# EAGLE schematic helper_tray_storage_station_v4 (EAGLE 8.0.1)

## Sheet 1 of 5
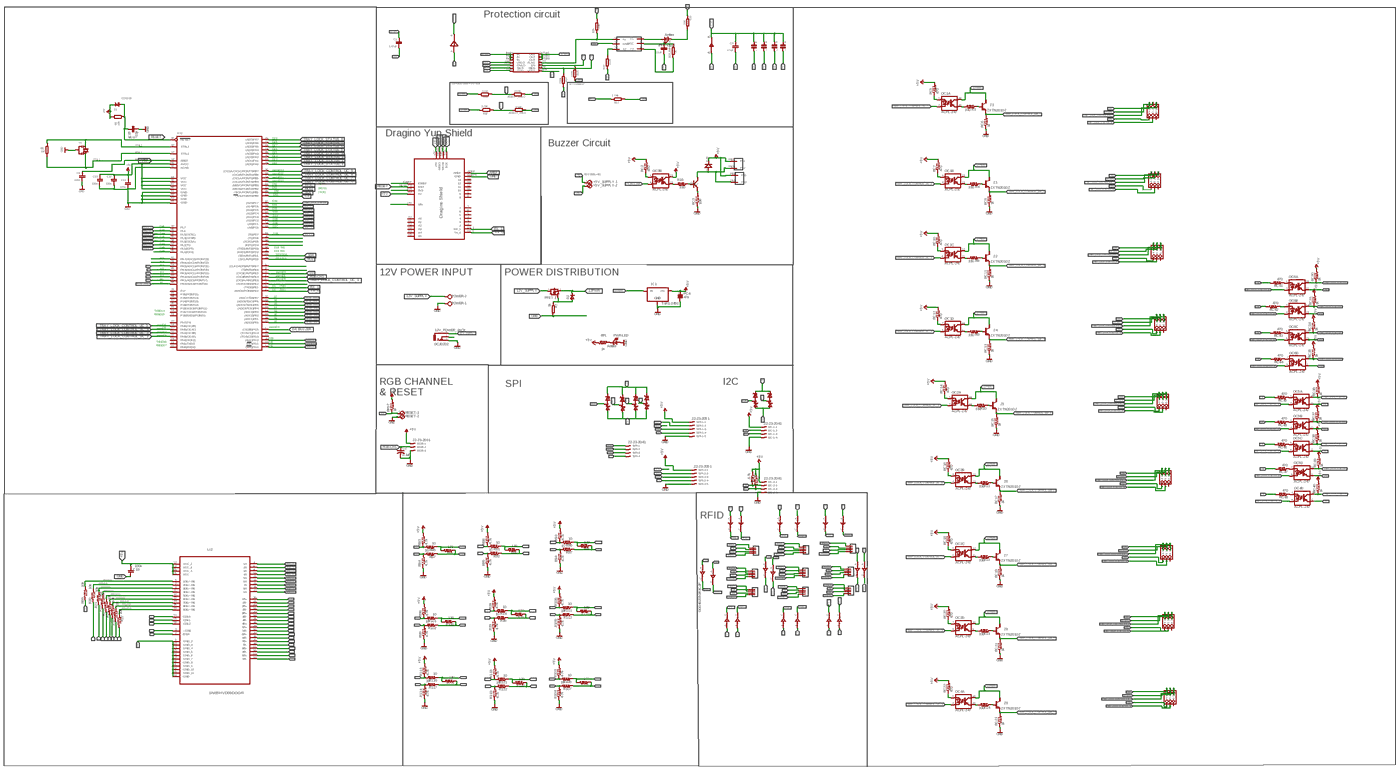
[diagram p0: schematic, sheet 1, overview]
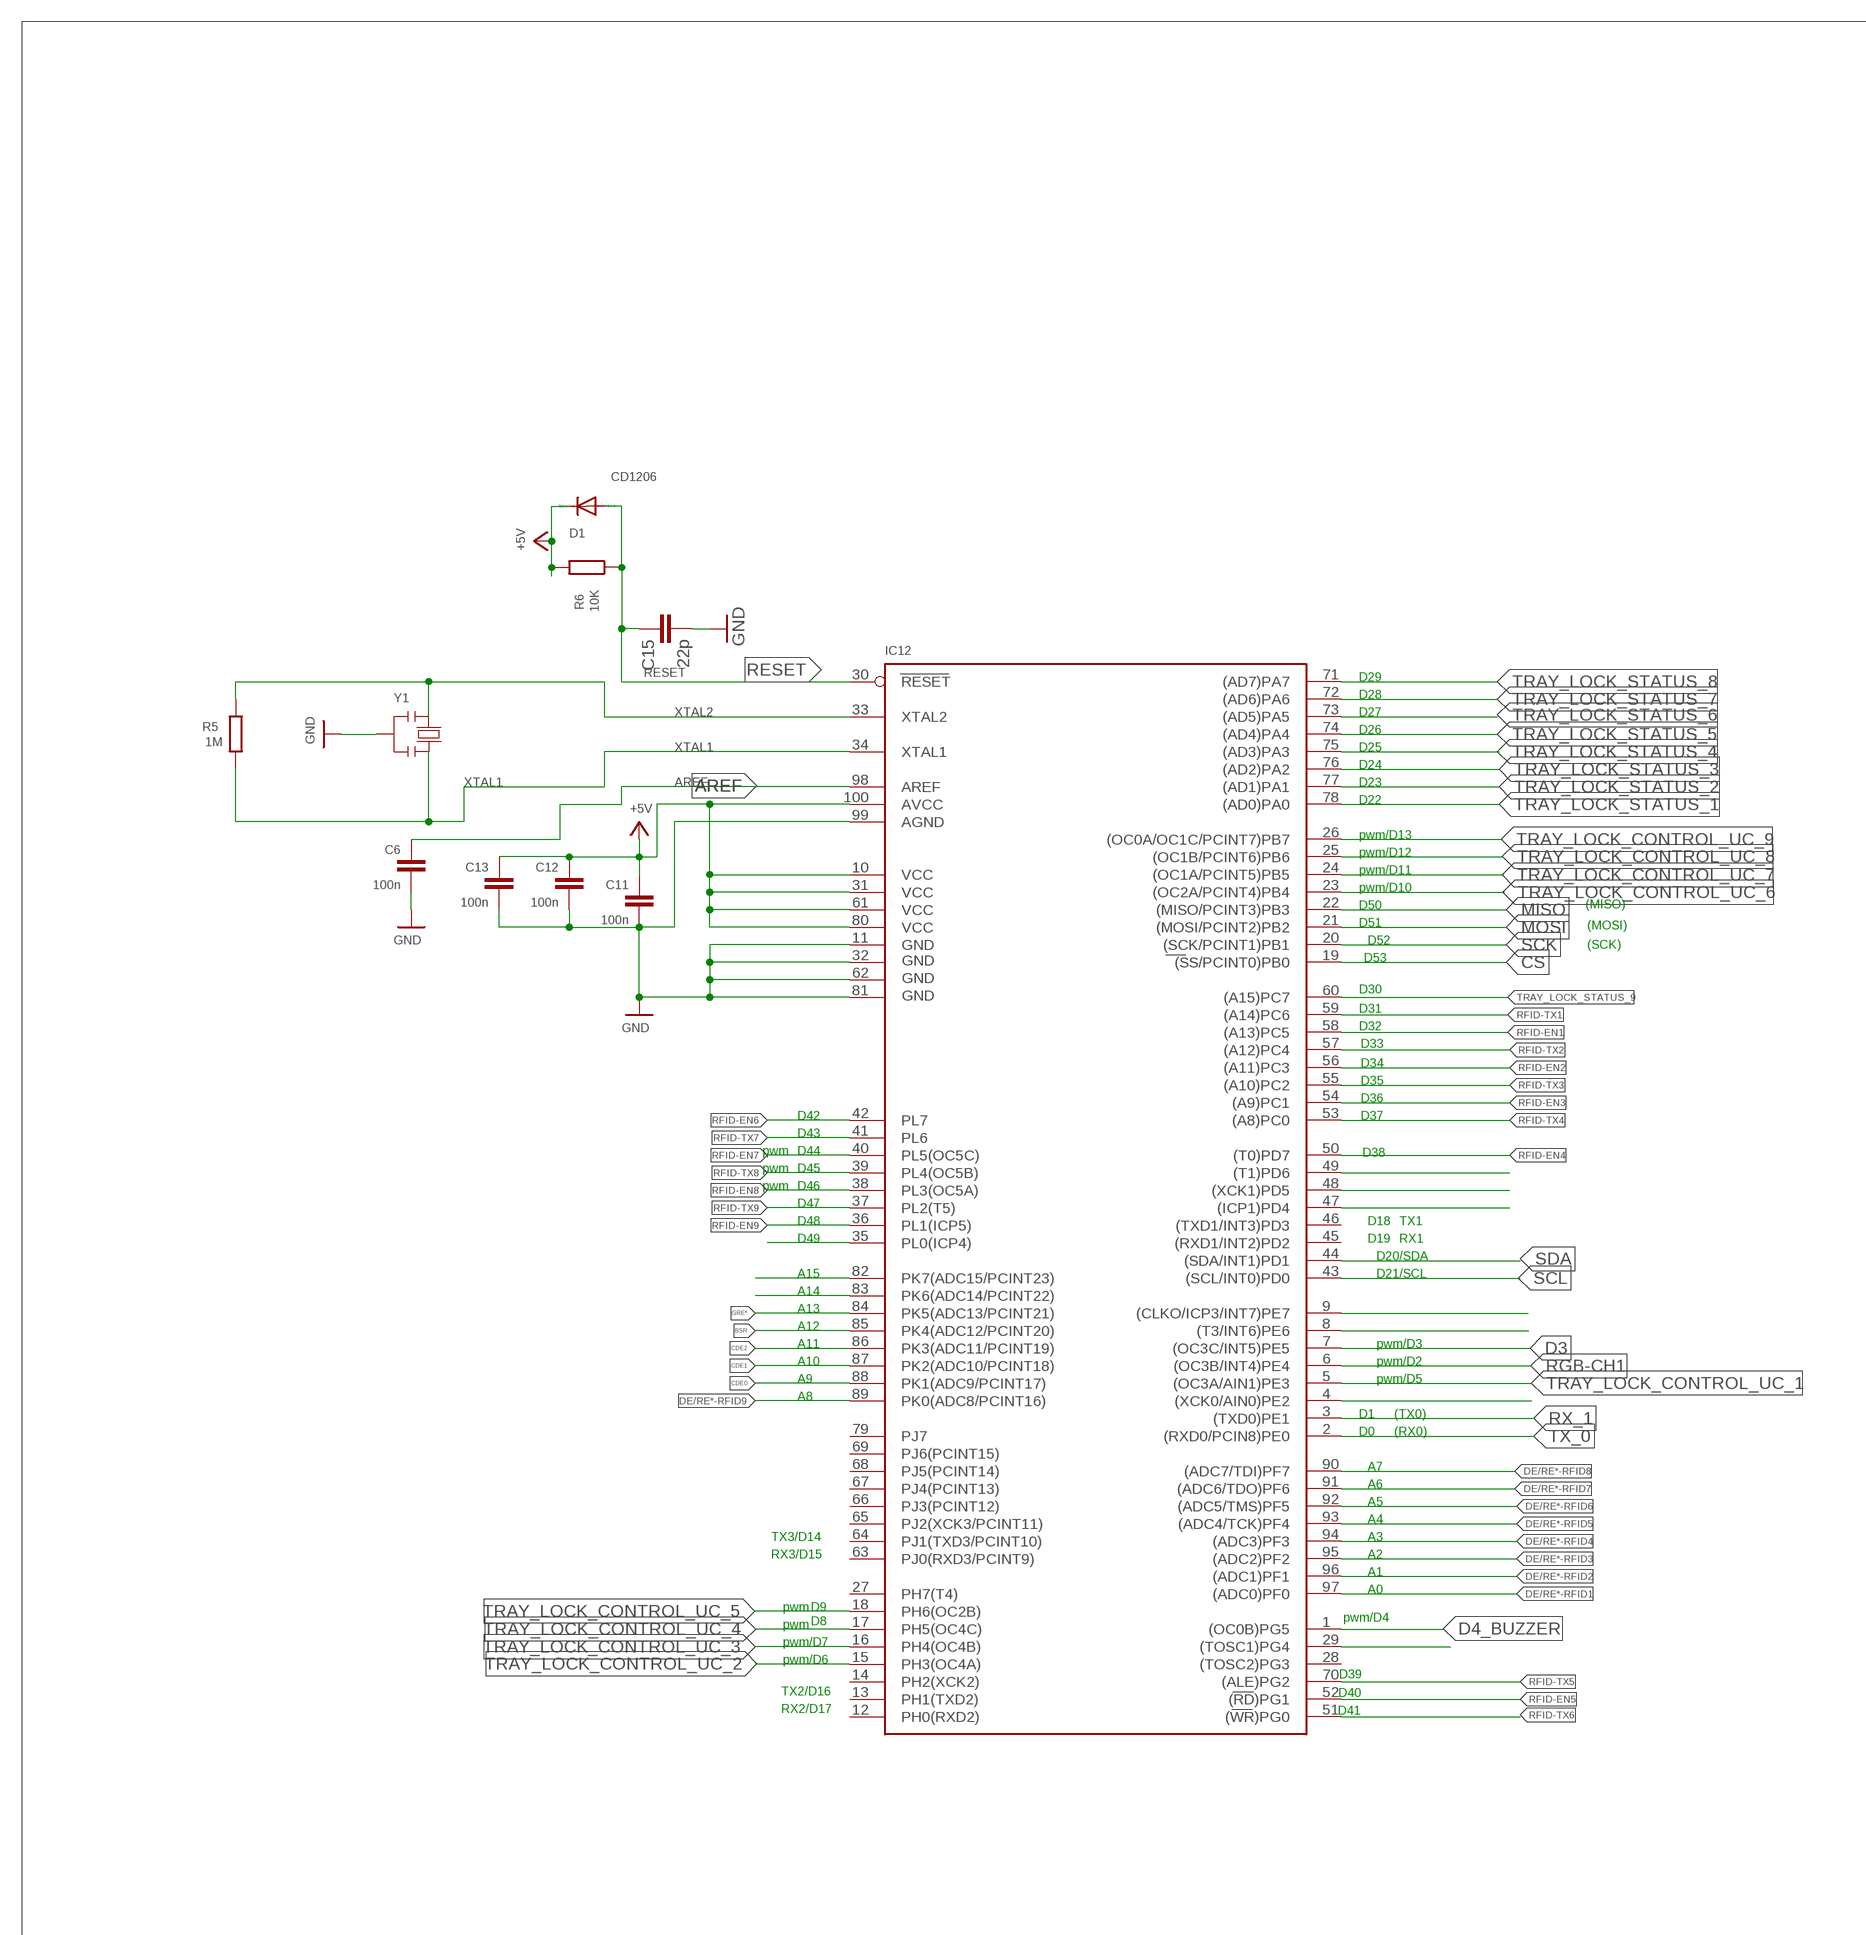
[diagram p1: schematic, sheet 1, part 1 of 6]
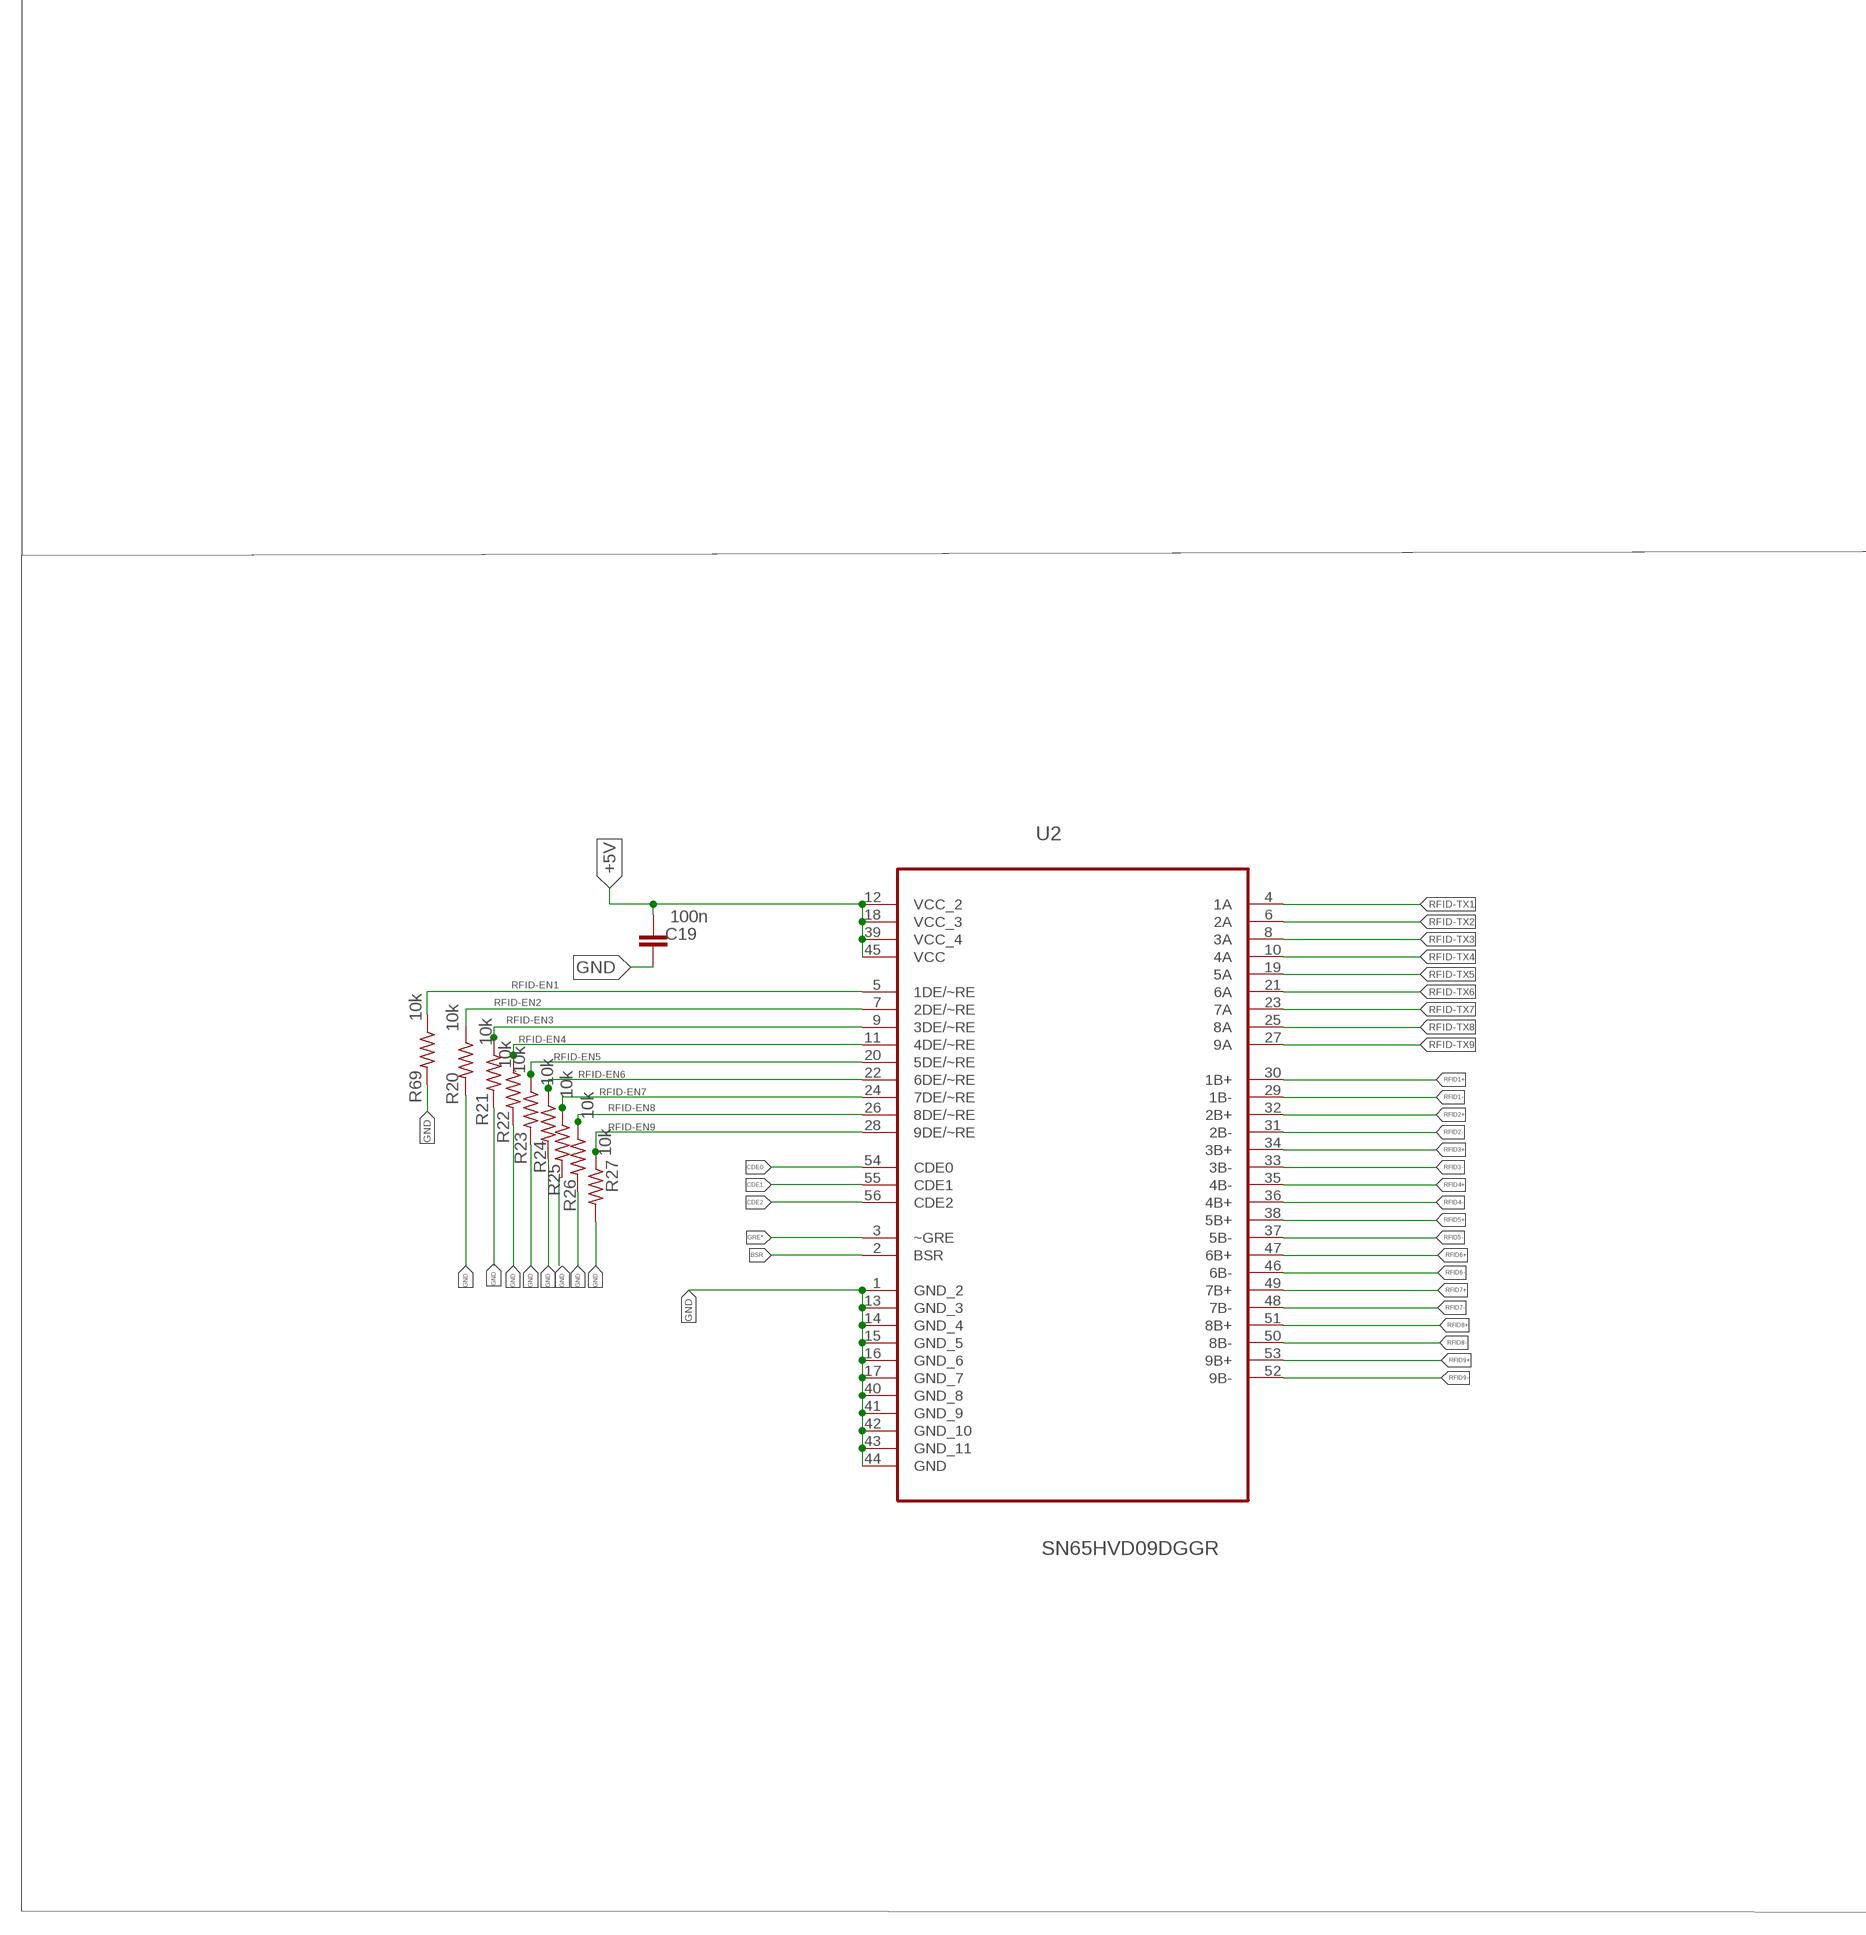
[diagram p2: schematic, sheet 1, part 2 of 6]
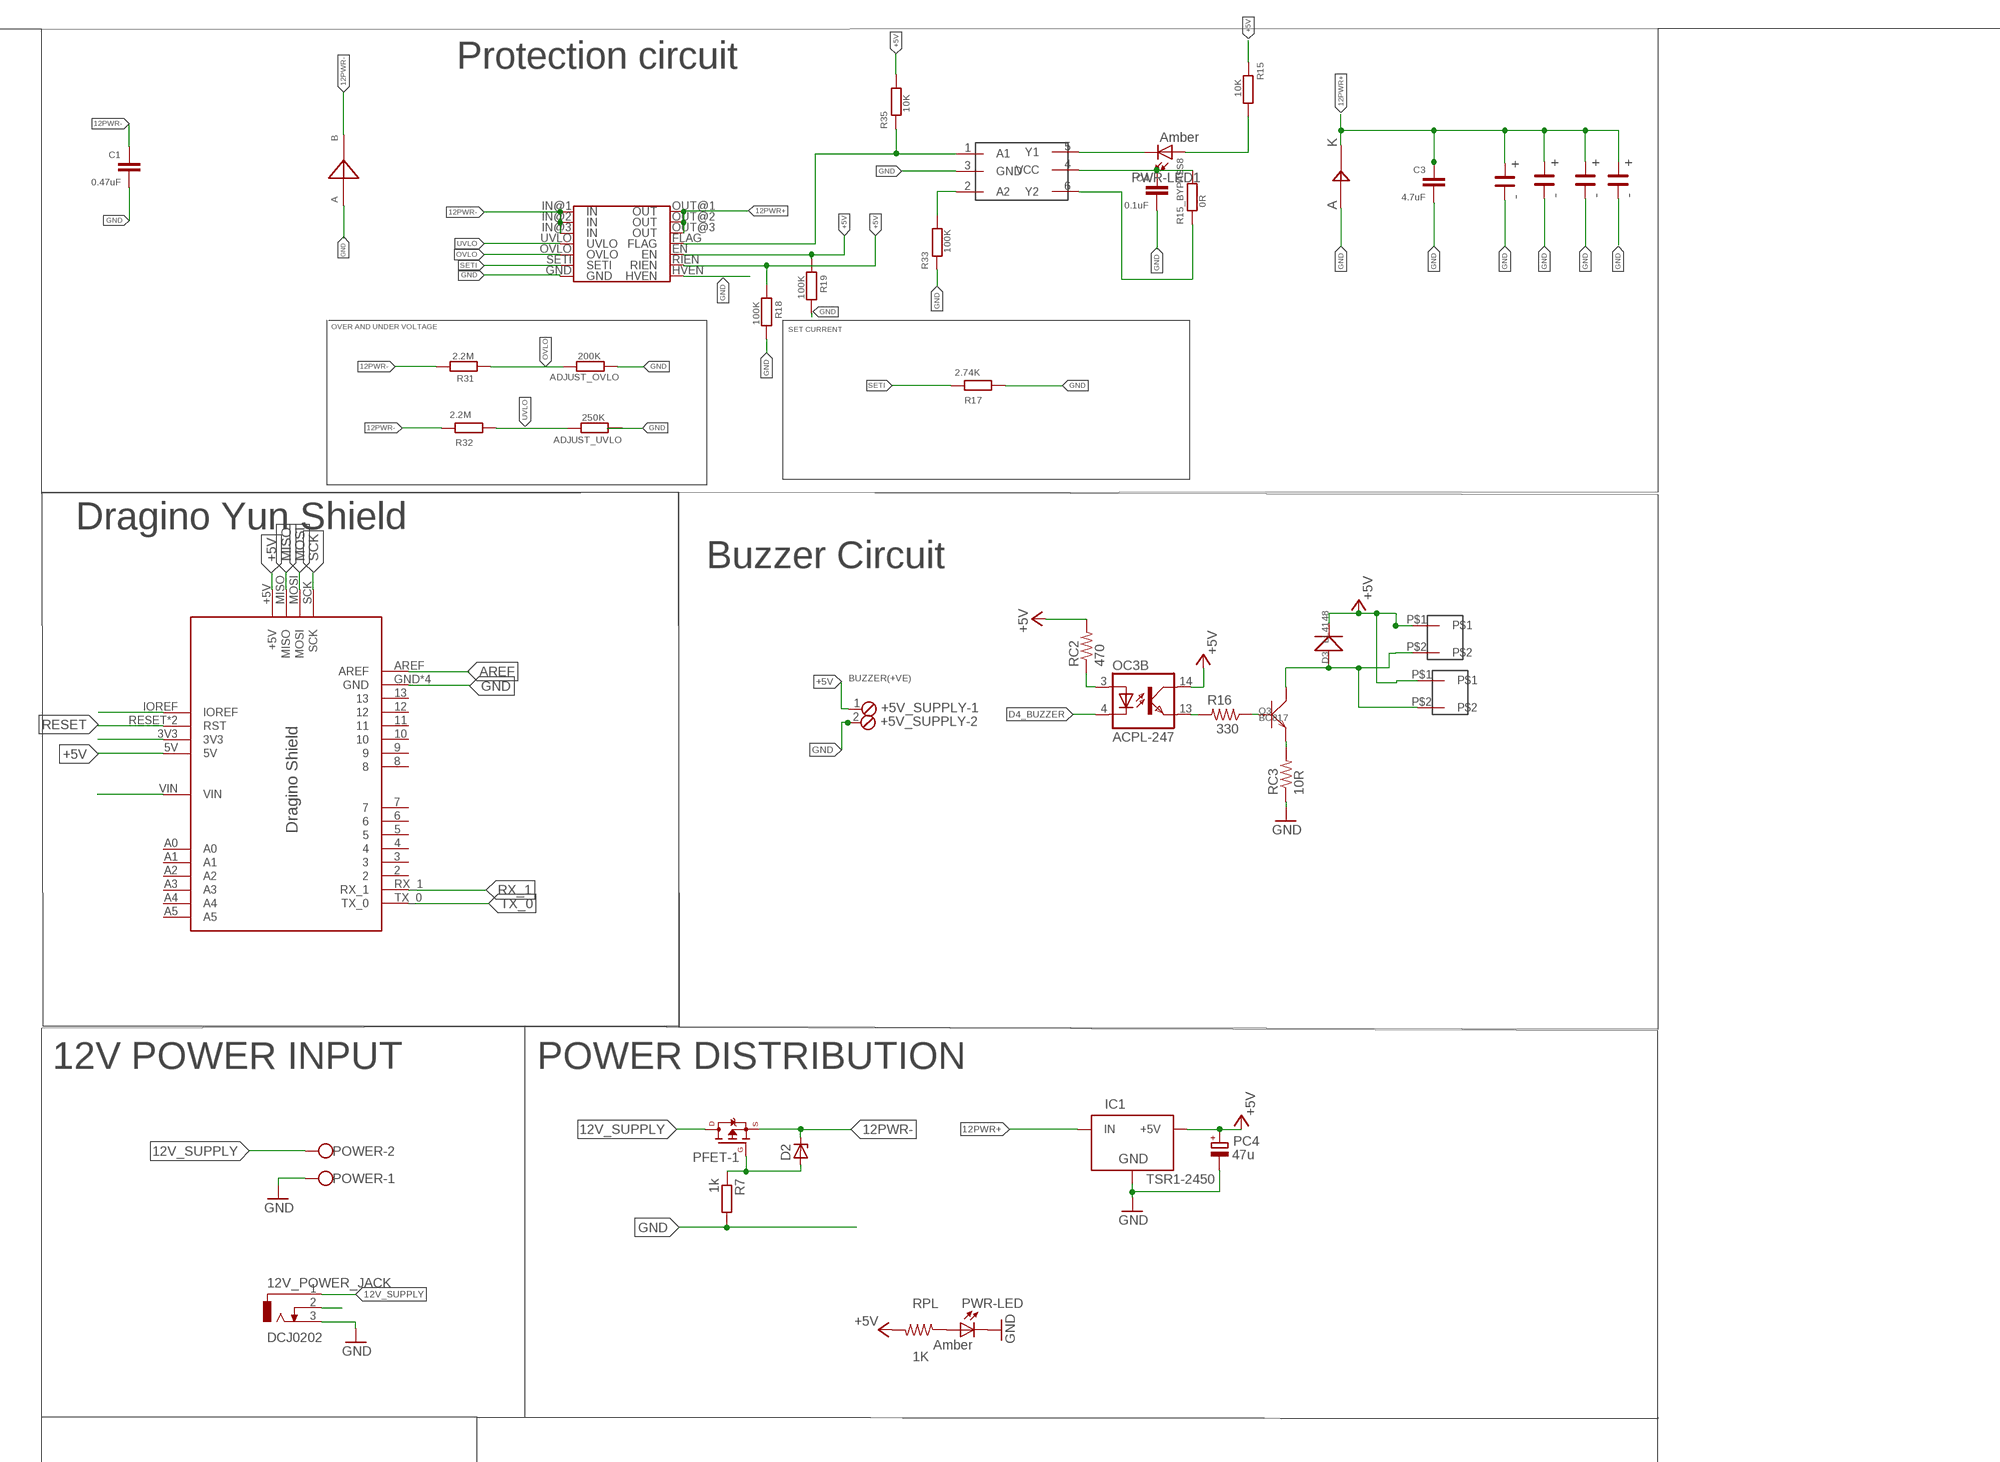
[diagram p3: schematic, sheet 1, part 3 of 6]
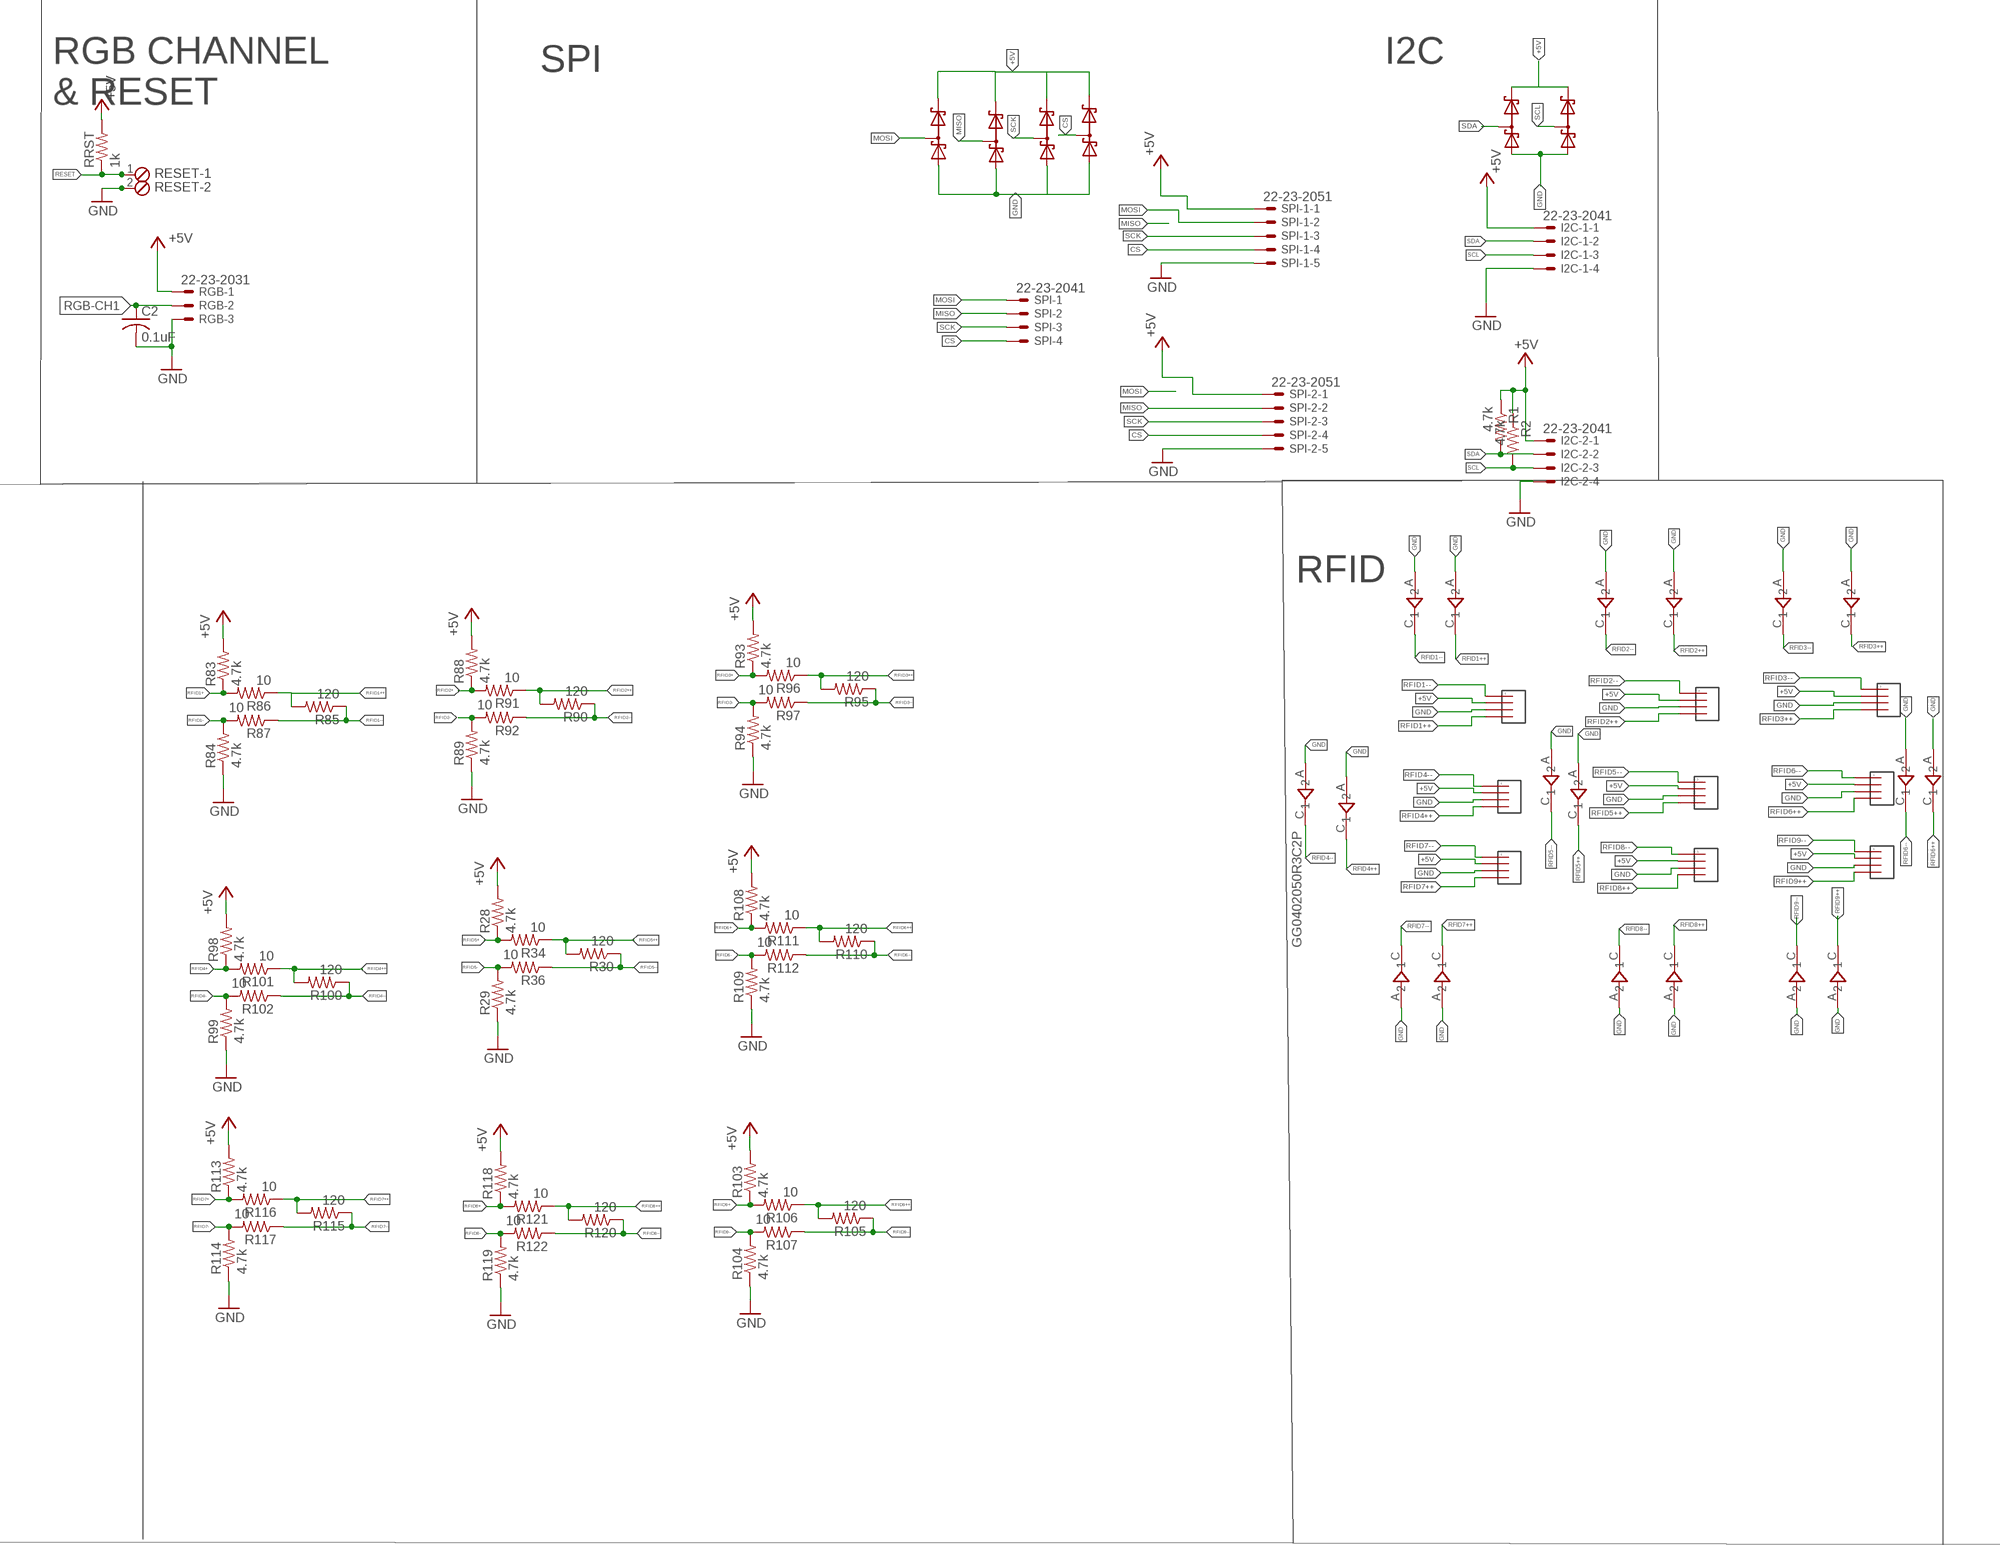
[diagram p4: schematic, sheet 1, part 4 of 6]
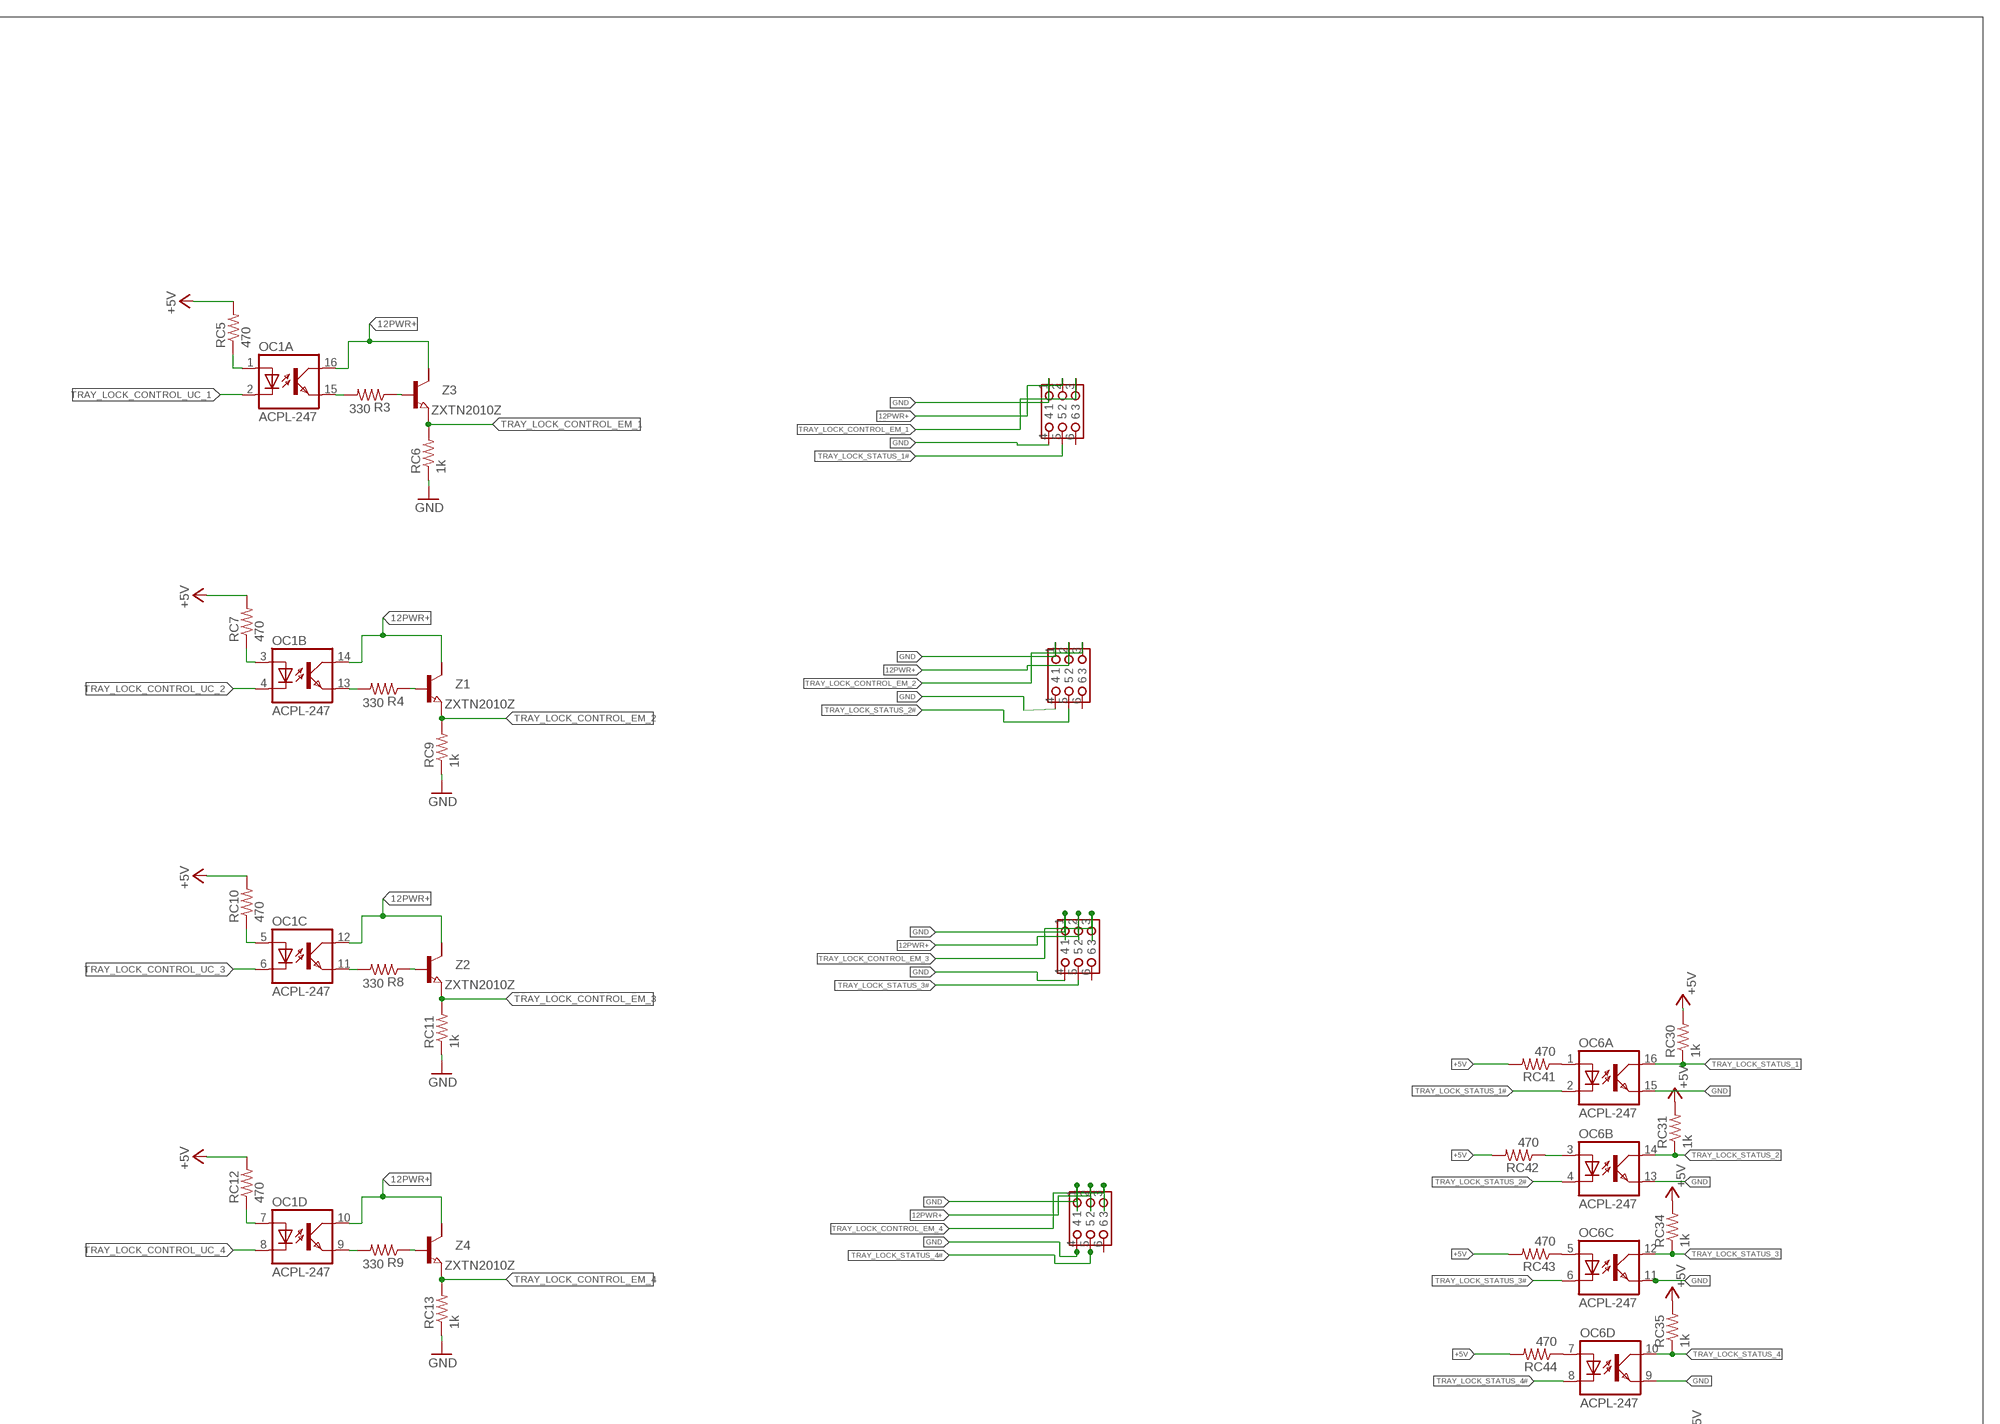
[diagram p5: schematic, sheet 1, part 5 of 6]
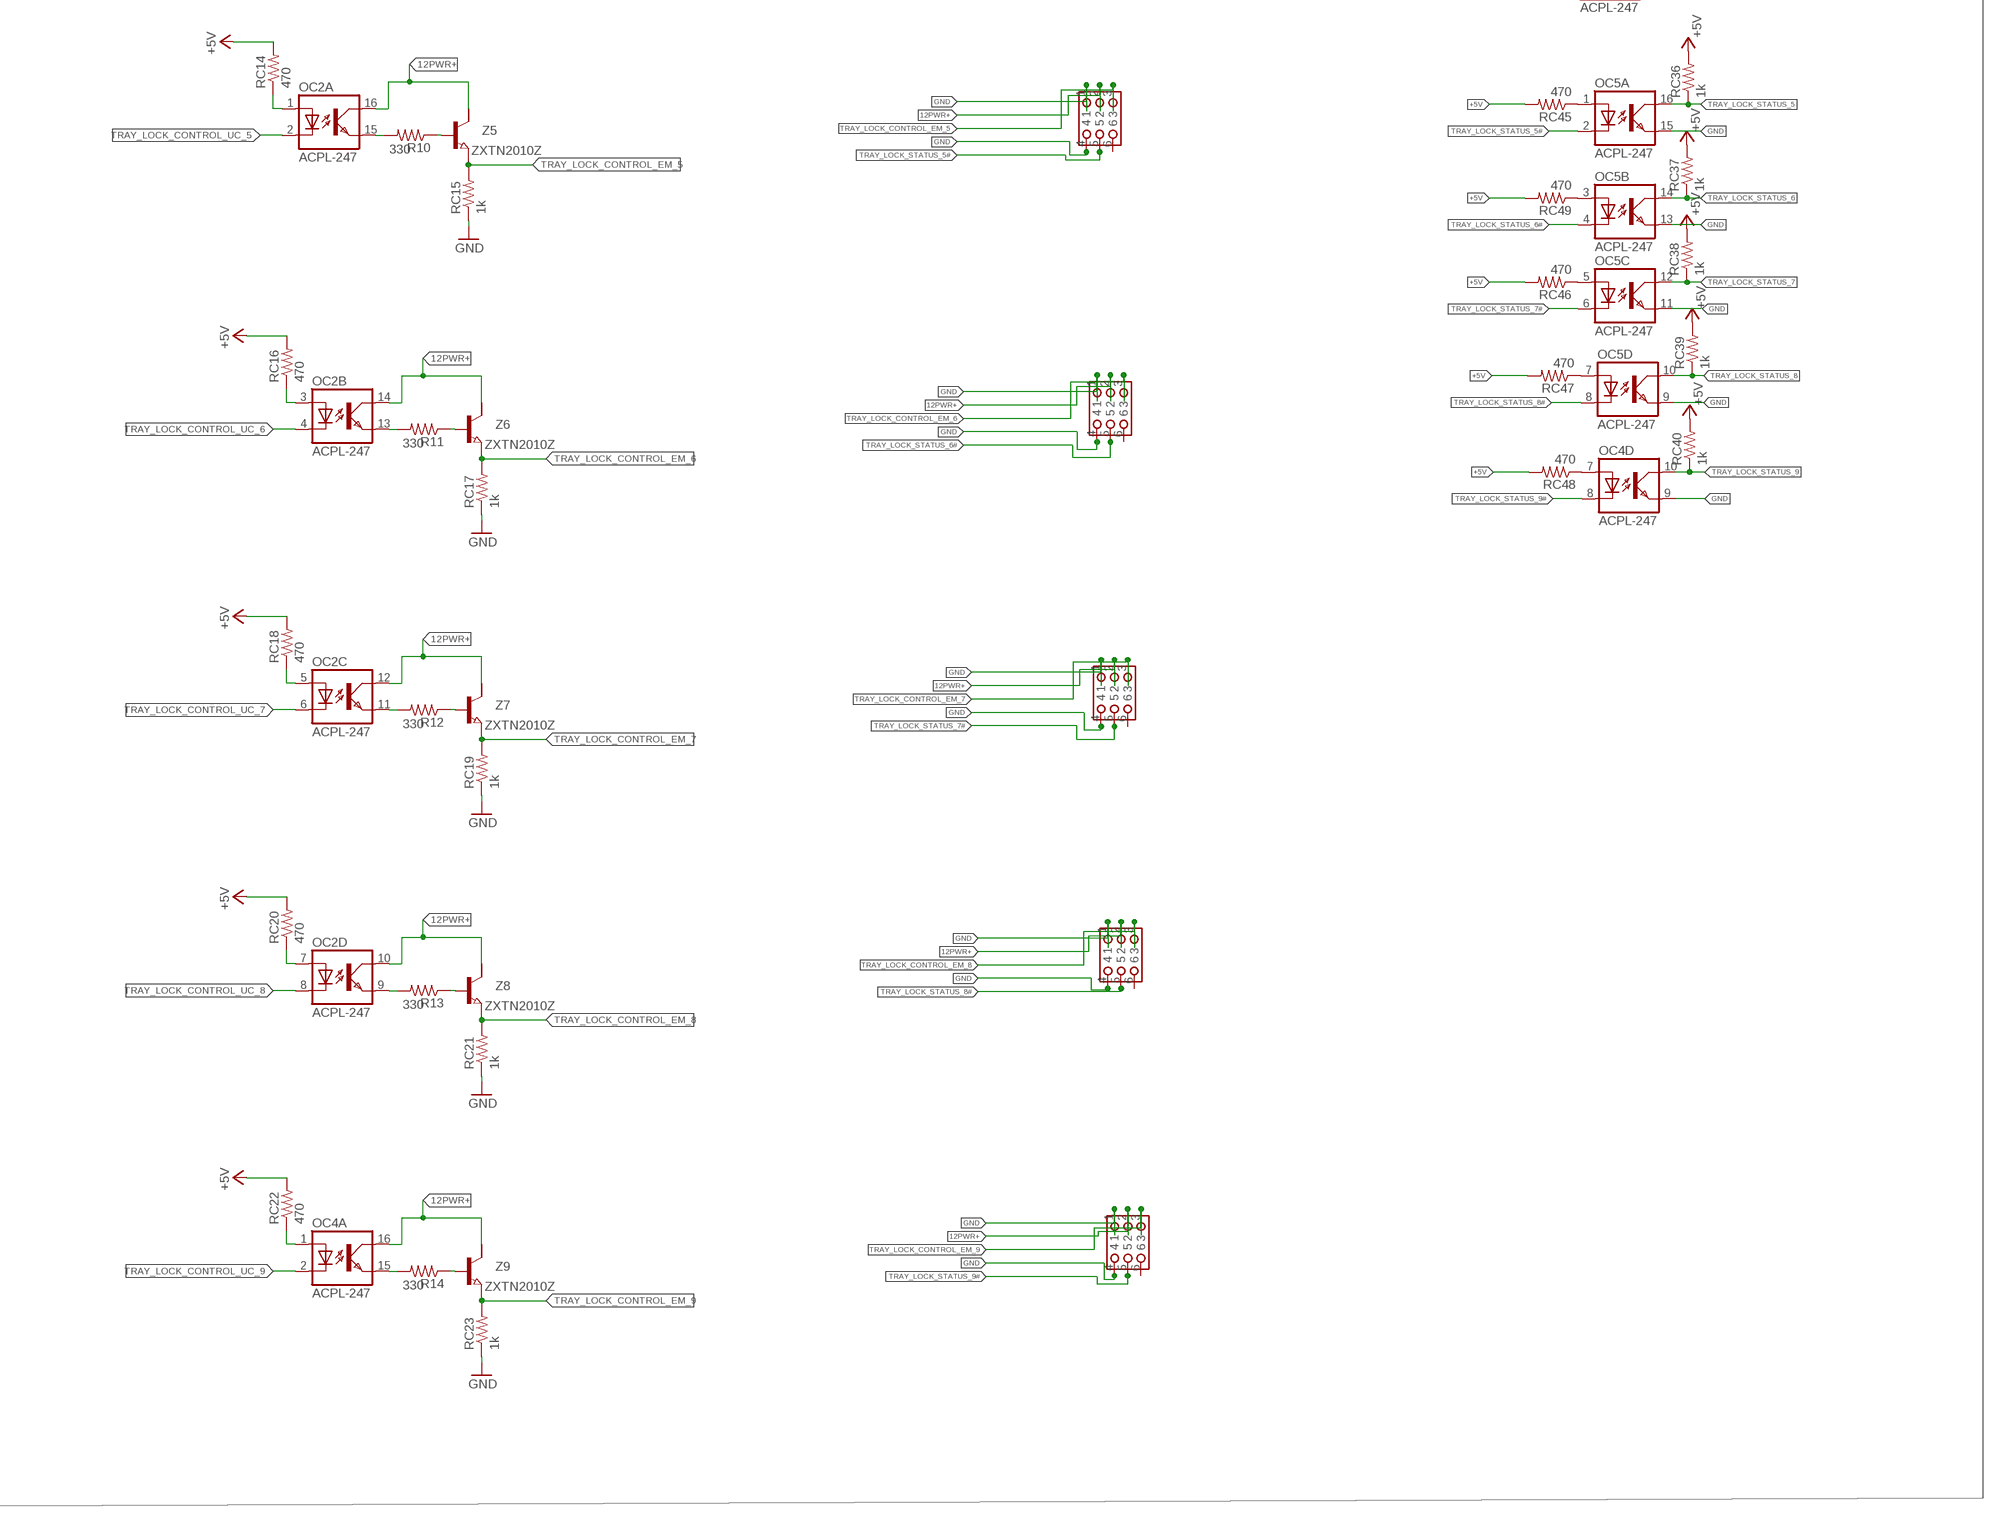
[diagram p6: schematic, sheet 1, part 6 of 6]

### Parts
12V_POWER_JACK  DCJ0202  [DCJ0202]
+5V_SUPPLY  MPT2  [2POL254]
ADJUST_OVLO  200K  R-EU_R0603  [R0603-ROUND]
ADJUST_UVLO  250K  R-EU_R0603  [R0603-ROUND]
C1  0.47uF  C-EU0603-RND  [C0603-ROUND]
C2  0.1uF  C-USC0603K  [C0603K]
C3  4.7uF  C-EU0603-RND  [C0603-ROUND]
C4  0.1uF  C-EU0603-RND  [C0603-ROUND]
C6  100n  C-EU0603-RND  [C0603-ROUND]
C11  100n  C-EU0603-RND  [C0603-ROUND]
C12  100n  C-EU0603-RND  [C0603-ROUND]
C13  100n  C-EU0603-RND  [C0603-ROUND]
C15  22p  C-EU0603-RND  [C0603-ROUND]
C19  100n  C-EU0603-RND  [C0603-ROUND]
D1  CD1206  DIODE-MINIMELF  [MINIMELF]
D2  1SMA5925BT3G  [DO214AC]
D3  LL4148  D'1N4148-SMD'  [LL-34]
I2C-1  22-23-2041  [22-23-2041]
I2C-2  22-23-2041  [22-23-2041]
IC1  TSR1-2450  [TSR-1]
IC12  ATMEGA25602560-16AU  [TQFP100]
OC1  ACPL-247  [SOP16]
OC2  ACPL-247  [SOP16]
OC3  ACPL-247  [SOP16]
OC4  ACPL-247  [SOP16]
OC5  ACPL-247  [SOP16]
OC6  ACPL-247  [SOP16]
PC4  47u  CPOL-EUD  [PANASONIC_D]
PFET-1  FQP47P06NORMAL  [FQP47P06-NORMAL]
POWER  W237-102  [W237-102]
PWR-LED  Amber  LED0603  [LED-0603]
PWR-LED1  Amber  LED0603  [LED-0603]
Q3  BC817  TRANSISTOR-NPN-SOT23  [SOT23]
R1  4.7k  RESISTOR0603-RES  [0603-RES]
R2  4.7k  RESISTOR0603-RES  [0603-RES]
R3  330  R-US_R0603  [R0603]
R4  330  R-US_R0603  [R0603]
R5  1M  R-EU_R0603  [R0603-ROUND]
R6  10K  R-EU_R0603  [R0603-ROUND]
R7  1k  R-EU_R0603  [R0603]
R8  330  R-US_R0603  [R0603]
R9  330  R-US_R0603  [R0603]
R10  330  R-US_R0603  [R0603]
R11  330  R-US_R0603  [R0603]
R12  330  R-US_R0603  [R0603]
R13  330  R-US_R0603  [R0603]
R14  330  R-US_R0603  [R0603]
R15  10K  R-EU_R0603  [R0603-ROUND]
R15_BYPASS8  0R  R-EU_R0603  [R0603-ROUND]
R16  330  R-US_R0603  [R0603]
R17  2.74K  R-EU_R0603  [R0603-ROUND]
R18  100K  R-EU_R0603  [R0603-ROUND]
R19  100K  R-EU_R0603  [R0603-ROUND]
R20  10k  R-US_R0603  [R0603]
R21  10k  R-US_R0603  [R0603]
R22  10k  R-US_R0603  [R0603]
R23  10k  R-US_R0603  [R0603]
R24  10k  R-US_R0603  [R0603]
R25  10k  R-US_R0603  [R0603]
R26  10k  R-US_R0603  [R0603]
R27  10k  R-US_R0603  [R0603]
R28  4.7k  R-US_R0603  [R0603]
R29  4.7k  R-US_R0603  [R0603]
R30  120  R-US_R0603  [R0603]
R31  2.2M  R-EU_R0603  [R0603-ROUND]
R32  2.2M  R-EU_R0603  [R0603-ROUND]
R33  100K  R-EU_R0603  [R0603-ROUND]
R34  10  R-US_R0603  [R0603]
R35  10K  R-EU_R0603  [R0603-ROUND]
R36  10  R-US_R0603  [R0603]
R69  10k  R-US_R0603  [R0603]
R83  4.7k  R-US_R0603  [R0603]
R84  4.7k  R-US_R0603  [R0603]
R85  120  R-US_R0603  [R0603]
R86  10  R-US_R0603  [R0603]
R87  10  R-US_R0603  [R0603]
R88  4.7k  R-US_R0603  [R0603]
R89  4.7k  R-US_R0603  [R0603]
R90  120  R-US_R0603  [R0603]
R91  10  R-US_R0603  [R0603]
R92  10  R-US_R0603  [R0603]
R93  4.7k  R-US_R0603  [R0603]
R94  4.7k  R-US_R0603  [R0603]
R95  120  R-US_R0603  [R0603]
R96  10  R-US_R0603  [R0603]
R97  10  R-US_R0603  [R0603]
R98  4.7k  R-US_R0603  [R0603]
R99  4.7k  R-US_R0603  [R0603]
R100  120  R-US_R0603  [R0603]
R101  10  R-US_R0603  [R0603]
R102  10  R-US_R0603  [R0603]
R103  4.7k  R-US_R0603  [R0603]
R104  4.7k  R-US_R0603  [R0603]
R105  120  R-US_R0603  [R0603]
R106  10  R-US_R0603  [R0603]
R107  10  R-US_R0603  [R0603]
R108  4.7k  R-US_R0603  [R0603]
R109  4.7k  R-US_R0603  [R0603]
R110  120  R-US_R0603  [R0603]
R111  10  R-US_R0603  [R0603]
R112  10  R-US_R0603  [R0603]
R113  4.7k  R-US_R0603  [R0603]
R114  4.7k  R-US_R0603  [R0603]
R115  120  R-US_R0603  [R0603]
R116  10  R-US_R0603  [R0603]
R117  10  R-US_R0603  [R0603]
R118  4.7k  R-US_R0603  [R0603]
R119  4.7k  R-US_R0603  [R0603]
R120  120  R-US_R0603  [R0603]
R121  10  R-US_R0603  [R0603]
R122  10  R-US_R0603  [R0603]
RC2  470  R-US_R0603  [R0603]
RC3  10R  R-US_R0603  [R0603]
RC5  470  R-US_R0603  [R0603]
RC6  1k  R-US_R0603  [R0603]
RC7  470  R-US_R0603  [R0603]
RC9  1k  R-US_R0603  [R0603]
RC10  470  R-US_R0603  [R0603]
RC11  1k  R-US_R0603  [R0603]
RC12  470  R-US_R0603  [R0603]
RC13  1k  R-US_R0603  [R0603]
RC14  470  R-US_R0603  [R0603]
RC15  1k  R-US_R0603  [R0603]
RC16  470  R-US_R0603  [R0603]
RC17  1k  R-US_R0603  [R0603]
RC18  470  R-US_R0603  [R0603]
RC19  1k  R-US_R0603  [R0603]
RC20  470  R-US_R0603  [R0603]
RC21  1k  R-US_R0603  [R0603]
RC22  470  R-US_R0603  [R0603]
RC23  1k  R-US_R0603  [R0603]
RC30  1k  R-US_R0603  [R0603]
RC31  1k  R-US_R0603  [R0603]
RC34  1k  R-US_R0603  [R0603]
RC35  1k  R-US_R0603  [R0603]
RC36  1k  R-US_R0603  [R0603]
RC37  1k  R-US_R0603  [R0603]
RC38  1k  R-US_R0603  [R0603]
RC39  1k  R-US_R0603  [R0603]
RC40  1k  R-US_R0603  [R0603]
RC41  470  R-US_R0603  [R0603]
RC42  470  R-US_R0603  [R0603]
RC43  470  R-US_R0603  [R0603]
RC44  470  R-US_R0603  [R0603]
RC45  470  R-US_R0603  [R0603]
RC46  470  R-US_R0603  [R0603]
RC47  470  R-US_R0603  [R0603]
RC48  470  R-US_R0603  [R0603]
RC49  470  R-US_R0603  [R0603]
RESET  MPT2  [2POL254]
RFID-1  MOLEX-105309-1104  [MOLEX-105309-1104]
RFID-2  MOLEX-105309-1104  [MOLEX-105309-1104]
RFID-3  MOLEX-105309-1104  [MOLEX-105309-1104]
RFID-4  MOLEX-105309-1104  [MOLEX-105309-1104]
RFID-5  MOLEX-105309-1104  [MOLEX-105309-1104]
RFID-6  MOLEX-105309-1104  [MOLEX-105309-1104]
RFID-7  MOLEX-105309-1104  [MOLEX-105309-1104]
RFID-8  MOLEX-105309-1104  [MOLEX-105309-1104]
RGB  22-23-2031  [22-23-2031]
RPL  1K  RESISTOR0603-RES  [0603-RES]
RRST  1k  R-US_R0603  [R0603]
SPI  22-23-2041  [22-23-2041]
SPI-1  22-23-2051  [22-23-2051]
SPI-2  22-23-2051  [22-23-2051]
U2  SN65HVD09DGGR  [SOP50P810X120-56N]
U$1  DRAGINO_SHIELD  [DRAGINO_SHIELD]
U$2  BUZZER  [BUZZER]
U$3  BUZZER  [BUZZER]
U$4  GG0402050R3C2P  [0402]
U$5  43045-0624-0624_CONNECTOR_2X3  [43045-0624_CONNECTOR_2X3]
U$6  43045-0624-0624_CONNECTOR_2X3  [43045-0624_CONNECTOR_2X3]
U$7  43045-0624-0624_CONNECTOR_2X3  [43045-0624_CONNECTOR_2X3]
U$8  43045-0624-0624_CONNECTOR_2X3  [43045-0624_CONNECTOR_2X3]
U$9  43045-0624-0624_CONNECTOR_2X3  [43045-0624_CONNECTOR_2X3]
U$10  43045-0624-0624_CONNECTOR_2X3  [43045-0624_CONNECTOR_2X3]
U$11  43045-0624-0624_CONNECTOR_2X3  [43045-0624_CONNECTOR_2X3]
U$12  43045-0624-0624_CONNECTOR_2X3  [43045-0624_CONNECTOR_2X3]
U$13  43045-0624-0624_CONNECTOR_2X3  [43045-0624_CONNECTOR_2X3]
U$14  GG0402050R3C2P  [0402]
U$15  GG0402050R3C2P  [0402]
U$16  GG0402050R3C2P  [0402]
U$17  GG0402050R3C2P  [0402]
U$18  GG0402050R3C2P  [0402]
U$19  GG0402050R3C2P  [0402]
U$20  GG0402050R3C2P  [0402]
U$21  GG0402050R3C2P  [0402]
U$22  GG0402050R3C2P  [0402]
U$23  GG0402050R3C2P  [0402]
U$24  GG0402050R3C2P  [0402]
U$25  GG0402050R3C2P  [0402]
U$26  GG0402050R3C2P  [0402]
U$27  GG0402050R3C2P  [0402]
U$28  GG0402050R3C2P  [0402]
U$29  GG0402050R3C2P  [0402]
U$30  GG0402050R3C2P  [0402]
U$31  NUP1301SOT23  [SOT23]
U$32  NUP1301SOT23  [SOT23]
U$33  NUP1301SOT23  [SOT23]
U$34  NUP1301SOT23  [SOT23]
U$35  NUP1301SOT23  [SOT23]
U$36  NUP1301SOT23  [SOT23]
U$37  MAX14571  [TSSOP14]
U$38  STPS5L60S  [SMC]
U$39  SM6T36CA  [DO214AA]
U$40  NC7WZ07P6X  [SC70-6L]
U$41  EEV-FK1H331Q  [EEVFK1H331Q]
U$42  EEV-FK1H331Q  [EEVFK1H331Q]
U$43  EEV-FK1H331Q  [EEVFK1H331Q]
U$44  EEV-FK1H331Q  [EEVFK1H331Q]
U$53  MOLEX-105309-1104  [MOLEX-105309-1104]
Y1  RESONATORMU  [RESONATOR]
Z1  ZXTN2010Z  NPN-TRANSISTIOR-2COLSOT89  [SOT89]
Z2  ZXTN2010Z  NPN-TRANSISTIOR-2COLSOT89  [SOT89]
Z3  ZXTN2010Z  NPN-TRANSISTIOR-2COLSOT89  [SOT89]
Z4  ZXTN2010Z  NPN-TRANSISTIOR-2COLSOT89  [SOT89]
Z5  ZXTN2010Z  NPN-TRANSISTIOR-2COLSOT89  [SOT89]
Z6  ZXTN2010Z  NPN-TRANSISTIOR-2COLSOT89  [SOT89]
Z7  ZXTN2010Z  NPN-TRANSISTIOR-2COLSOT89  [SOT89]
Z8  ZXTN2010Z  NPN-TRANSISTIOR-2COLSOT89  [SOT89]
Z9  ZXTN2010Z  NPN-TRANSISTIOR-2COLSOT89  [SOT89]

### Nets
12PWR+ [PWR]: C3.1 IC1.1(IN) OC1.10(D:COL) OC1.12(C:COL) OC1.14(B:COL) OC1.16(A:COL) OC2.10(D:COL) OC2.12(C:COL) OC2.14(B:COL) OC2.16(A:COL) OC4.16(A:COL) U$5.2 U$6.2 U$7.2 U$8.2 U$9.2 U$10.2 U$11.2 U$12.2 U$13.2 U$37.OUT@1(OUT) U$37.OUT@2(OUT) U$37.OUT@3(OUT) U$38.1 U$41.P$2 U$42.P$2 U$43.P$2 U$44.P$2 Z1.2(C) Z2.2(C) Z3.2(C) Z4.2(C) Z5.2(C) Z6.2(C) Z7.2(C) Z8.2(C) Z9.2(C)
12PWR- [PWR]: C1.1 D2.C PFET-1.3(S) R31.1 R32.1 U$37.IN@1(IN) U$37.IN@2(IN) U$37.IN@3(IN) U$39.C
12V_SUPPLY [PWR]: 12V_POWER_JACK.1 PFET-1.2(D) POWER.2
+5V [power]: +5V_SUPPLY.1 C4.1 C11.1 C12.1 C13.1 C19.1 D1.C D3.C(-) I2C-1.1 I2C-2.1 IC1.3(+5V) IC12.10(VCC) IC12.31(VCC1) IC12.61(VCC2) IC12.80(VCC3) IC12.100(AVCC) OC3.14(B:COL) PC4.+ R1.1 R2.1 R6.2 R15.2 R15_BYPASS8.1 R18.2 R19.2 R28.2 R35.1 R83.2 R88.2 R93.2 R98.2 R103.2 R108.2 R113.2 R118.2 RC2.2 RC5.2 RC7.2 RC10.2 RC12.2 RC14.2 RC16.2 RC18.2 RC20.2 RC22.2 RC30.2 RC31.2 RC34.2 RC35.2 RC36.2 RC37.2 RC38.2 RC39.2 RC40.2 RC41.2 RC42.2 RC43.2 RC44.2 RC45.2 RC46.2 RC47.2 RC48.2 RC49.2 RFID-1.P$2 RFID-2.P$2 RFID-3.P$2 RFID-4.P$2 RFID-5.P$2 RFID-6.P$2 RFID-7.P$2 RFID-8.P$2 RGB.1 RPL.2 RRST.2 SPI-1.1 SPI-2.1 U2.12(VCC_2) U2.18(VCC_3) U2.39(VCC_4) U2.45(VCC) U$1.5V U$1.+5V U$2.P$1 U$3.P$1 U$31.2(A2) U$32.2(A2) U$33.2(A2) U$34.2(A2) U$35.2(A2) U$36.2(A2) U$37.EN U$37.RIEN U$40.4(VCC) U$53.P$2
AREF: C6.1 IC12.98(AREF) U$1.AREF
BSR: IC12.85(PK4(ADC12/PCINT20)) U2.2(BSR)
CDE0: IC12.88(PK1(ADC9/PCINT17)) U2.54(CDE0)
CDE1: IC12.87(PK2(ADC10/PCINT18)) U2.55(CDE1)
CDE2: IC12.86(PK3(ADC11/PCINT19)) U2.56(CDE2)
CHARGER-PLUG-SENSOR: 12V_POWER_JACK.2
CS: IC12.19((SS/PCINT0)PB0) SPI-1.4 SPI-2.4 SPI.4 U$34.3(K1K2)
D3: IC12.7((OC3C/INT5)PE5)
D4_BUZZER: IC12.1((OC0B)PG5) OC3.4(B:C)
DE/RE*-RFID1: IC12.97((ADC0)PF0)
DE/RE*-RFID2: IC12.96((ADC1)PF1)
DE/RE*-RFID3: IC12.95((ADC2)PF2)
DE/RE*-RFID4: IC12.94((ADC3)PF3)
DE/RE*-RFID5: IC12.93((ADC4/TCK)PF4)
DE/RE*-RFID6: IC12.92((ADC5/TMS)PF5)
DE/RE*-RFID7: IC12.91((ADC6/TDO)PF6)
DE/RE*-RFID8: IC12.90((ADC7/TDI)PF7)
DE/RE*-RFID9: IC12.89(PK0(ADC8/PCINT16))
GND [PWR]: 12V_POWER_JACK.3 +5V_SUPPLY.2 ADJUST_OVLO.2 ADJUST_UVLO.2 C1.2 C2.2 C3.2 C4.2 C6.2 C11.2 C12.2 C13.2 C15.2 C19.2 I2C-1.4 I2C-2.4 IC1.2(GND) IC12.11(GND) IC12.32(GND1) IC12.62(GND2) IC12.81(GND3) IC12.99(AGND) OC4.9(D:EMIT) OC5.9(D:EMIT) OC5.11(C:EMIT) OC5.13(B:EMIT) OC5.15(A:EMIT) OC6.9(D:EMIT) OC6.11(C:EMIT) OC6.13(B:EMIT) OC6.15(A:EMIT) PC4.- POWER.1 PWR-LED.C R7.2 R17.2 R18.1 R19.1 R20.2 R21.2 R22.2 R23.2 R24.2 R25.2 R26.2 R27.2 R29.1 R33.2 R69.2 R84.1 R89.1 R94.1 R99.1 R104.1 R109.1 R114.1 R119.1 RC3.1 RC6.1 RC9.1 RC11.1 RC13.1 RC15.1 RC17.1 RC19.1 RC21.1 RC23.1 RESET.2 RFID-1.P$3 RFID-2.P$3 RFID-3.P$3 RFID-4.P$3 RFID-5.P$3 RFID-6.P$3 RFID-7.P$3 RFID-8.P$3 RGB.3 SPI-1.5 SPI-2.5 U2.1(GND_2) U2.13(GND_3) U2.14(GND_4) U2.15(GND_5) U2.16(GND_6) U2.17(GND_7) U2.40(GND_8) U2.41(GND_9) U2.42(GND_10) U2.43(GND_11) U2.44(GND) U$1.GND U$1.GND@1(GND) U$1.GND@2(GND) U$1.GND@3(GND) U$4.A U$5.1 U$5.4 U$6.1 U$6.4 U$7.1 U$7.4 U$8.1 U$8.4 U$9.1 U$9.4 U$10.1 U$10.4 U$11.1 U$11.4 U$12.1 U$12.4 U$13.1 U$13.4 U$14.A U$15.A U$16.A U$17.A U$18.A U$19.A U$20.A U$21.A U$22.A U$23.A U$24.A U$25.A U$26.A U$27.A U$28.A U$29.A U$30.A U$31.1(A1) U$32.1(A1) U$33.1(A1) U$34.1(A1) U$35.1(A1) U$36.1(A1) U$37.GND U$37.HVEN U$38.2 U$39.A U$40.3(GND) U$41.P$1 U$42.P$1 U$43.P$1 U$44.P$1 U$53.P$3 Y1.2
GRE*: IC12.84(PK5(ADC13/PCINT21)) U2.3(~GRE)
MISO: IC12.22((MISO/PCINT3)PB3) SPI-2.2 SPI.2 U$1.MISO U$32.3(K1K2)
MOSI: IC12.21((MOSI/PCINT2)PB2) SPI-1.2 SPI.1 U$1.MOSI U$31.3(K1K2)
N$1: OC6.1(A:A) RC41.1
N$2: D2.A PFET-1.1(G) R7.1
N$3: OC1.1(A:A) RC5.1
N$4: OC1.15(A:EMIT) R3.2
N$5: OC1.3(B:A) RC7.1
N$6: OC1.13(B:EMIT) R4.2
N$7: R4.1 Z1.1(B)
N$8: OC3.3(B:A) RC2.1
N$9: OC6.3(B:A) RC42.1
N$10: OC6.5(C:A) RC43.1
N$11: OC1.5(C:A) RC10.1
N$12: R3.1 Z3.1(B)
N$13: OC6.7(D:A) RC44.1
N$14: OC1.11(C:EMIT) R8.2
N$15: R8.1 Z2.1(B)
N$16: OC1.7(D:A) RC12.1
N$17: PWR-LED.A RPL.1
N$18: OC1.9(D:EMIT) R9.2
N$19: R9.1 Z4.1(B)
N$20: OC2.1(A:A) RC14.1
N$21: OC2.15(A:EMIT) R10.2
N$22: R10.1 Z5.1(B)
N$23: OC2.3(B:A) RC16.1
N$24: OC2.13(B:EMIT) R11.2
N$25: R11.1 Z6.1(B)
N$26: OC2.5(C:A) RC18.1
N$27: OC2.11(C:EMIT) R12.2
N$28: R12.1 Z7.1(B)
N$29: OC2.7(D:A) RC20.1
N$30: OC2.9(D:EMIT) R13.2
N$31: R13.1 Z8.1(B)
N$32: OC4.1(A:A) RC22.1
N$33: OC4.15(A:EMIT) R14.2
N$34: R14.1 Z9.1(B)
N$35: OC3.13(B:EMIT) R16.2
N$36: IC12.29((TOSC1)PG4)
N$37: Q3.1(B) R16.1
N$38: OC5.1(A:A) RC45.1
N$39: OC5.5(C:A) RC46.1
N$40: PWR-LED1.A R15.1
N$41: IC12.49((T1)PD6)
N$42: IC12.48((XCK1)PD5)
N$43: IC12.47((ICP1)PD4)
N$45: PWR-LED1.C U$40.5(Y1)
N$46: R33.1 U$40.2(A2)
N$47: IC12.82(PK7(ADC15/PCINT23))
N$48: IC12.83(PK6(ADC14/PCINT22))
N$49: OC5.7(D:A) RC47.1
N$50: OC4.7(D:A) RC48.1
N$51: OC5.3(B:A) RC49.1
N$55: R15_BYPASS8.2 U$40.6(Y2)
N$64: U$1.VIN
N$66: U$1.3V3
N$68: U$1.IOREF
N$75: IC12.4((XCK0/AIN0)PE2)
N$76: IC12.35(PL0(ICP4))
N$79: IC12.8((T3/INT6)PE6)
N$80: IC12.9((CLKO/ICP3/INT7)PE7)
OVLO: ADJUST_OVLO.1 R31.2 U$37.OVLO
R [PWR]: D3.A(+) Q3.3(C) U$2.P$2 U$3.P$2
RESET: C15.1 D1.A IC12.30(RESET) R6.1 RESET.1 RRST.1 U$1.RESET(RST) U$1.RST
RFID1+: R83.1 R86.2 U2.30(1B+)
RFID1++: R85.2 R86.1 RFID-1.P$4 U$14.C
RFID1-: R84.2 R87.2 U2.29(1B-)
RFID1--: R85.1 R87.1 RFID-1.P$1 U$4.C
RFID2+: R88.1 R91.2 U2.32(2B+)
RFID2++: R90.2 R91.1 RFID-2.P$4 U$16.C
RFID2-: R89.2 R92.2 U2.31(2B-)
RFID2--: R90.1 R92.1 RFID-2.P$1 U$15.C
RFID3+: R93.1 R96.2 U2.34(3B+)
RFID3++: R95.2 R96.1 RFID-3.P$4 U$18.C
RFID3-: R94.2 R97.2 U2.33(3B-)
RFID3--: R95.1 R97.1 RFID-3.P$1 U$17.C
RFID4+: R98.1 R101.2 U2.35(4B-)
RFID4++: R100.2 R101.1 RFID-4.P$4 U$20.C
RFID4-: R99.2 R102.2 U2.36(4B+)
RFID4--: R100.1 R102.1 RFID-4.P$1 U$19.C
RFID5+: R28.1 R34.2 U2.38(5B+)
RFID5++: R30.2 R34.1 RFID-5.P$4 U$22.C
RFID5-: R29.2 R36.2 U2.37(5B-)
RFID5--: R30.1 R36.1 RFID-5.P$1 U$21.C
RFID6+: R108.1 R111.2 U2.47(6B+)
RFID6++: R110.2 R111.1 RFID-6.P$4 U$24.C
RFID6-: R109.2 R112.2 U2.46(6B-)
RFID6--: R110.1 R112.1 RFID-6.P$1 U$23.C
RFID7+: R113.1 R116.2 U2.49(7B+)
RFID7++: R115.2 R116.1 U$26.C U$53.P$4
RFID7-: R114.2 R117.2 U2.48(7B-)
RFID7--: R115.1 R117.1 U$25.C U$53.P$1
RFID8+: R118.1 R121.2 U2.51(8B+)
RFID8++: R120.2 R121.1 RFID-8.P$4 U$28.C
RFID8-: R119.2 R122.2 U2.50(8B-)
RFID8--: R120.1 R122.1 RFID-8.P$1 U$27.C
RFID9+: R103.1 R106.2 U2.53(9B+)
RFID9++: R105.2 R106.1 RFID-7.P$4 U$30.C
RFID9-: R104.2 R107.2 U2.52(9B-)
RFID9--: R105.1 R107.1 RFID-7.P$1 U$29.C
RFID-EN1: IC12.58((A13)PC5) R69.1 U2.5(1DE/~RE)
RFID-EN2: IC12.56((A11)PC3) R20.1 U2.7(2DE/~RE)
RFID-EN3: IC12.54((A9)PC1) R21.1 U2.9(3DE/~RE)
RFID-EN4: IC12.50((T0)PD7) R22.1 U2.11(4DE/~RE)
RFID-EN5: IC12.52((RD)PG1) R23.1 U2.20(5DE/~RE)
RFID-EN6: IC12.42(PL7) R24.1 U2.22(6DE/~RE)
RFID-EN7: IC12.40(PL5(OC5C)) R25.1 U2.24(7DE/~RE)
RFID-EN8: IC12.38(PL3(OC5A)) R26.1 U2.26(8DE/~RE)
RFID-EN9: IC12.36(PL1(ICP5)) R27.1 U2.28(9DE/~RE)
RFID-TX1: IC12.59((A14)PC6) U2.4(1A)
RFID-TX2: IC12.57((A12)PC4) U2.6(2A)
RFID-TX3: IC12.55((A10)PC2) U2.8(3A)
RFID-TX4: IC12.53((A8)PC0) U2.10(4A)
RFID-TX5: IC12.70((ALE)PG2) U2.19(5A)
RFID-TX6: IC12.51((WR)PG0) U2.21(6A)
RFID-TX7: IC12.41(PL6) U2.23(7A)
RFID-TX8: IC12.39(PL4(OC5B)) U2.25(8A)
RFID-TX9: IC12.37(PL2(T5)) U2.27(9A)
RGB-CH1: C2.1 IC12.6((OC3B/INT4)PE4) RGB.2
RX_1: IC12.3((TXD0)PE1) U$1.RX_1
SCK: IC12.20((SCK/PCINT1)PB1) SPI-1.3 SPI-2.3 SPI.3 U$1.SCK U$33.3(K1K2)
SCL: I2C-1.3 I2C-2.3 IC12.43((SCL/INT0)PD0) R2.2 U$36.3(K1K2)
SDA: I2C-1.2 I2C-2.2 IC12.44((SDA/INT1)PD1) R1.2 U$35.3(K1K2)
SETI: R17.1 U$37.SETI
TRAY_LOCK_CONTROL_EM_1 [power]: RC6.2 U$13.3 Z3.3(E)
TRAY_LOCK_CONTROL_EM_2 [power]: RC9.2 U$12.3 Z1.3(E)
TRAY_LOCK_CONTROL_EM_3 [power]: RC11.2 U$5.3 Z2.3(E)
TRAY_LOCK_CONTROL_EM_4 [power]: RC13.2 U$6.3 Z4.3(E)
TRAY_LOCK_CONTROL_EM_5 [power]: RC15.2 U$7.3 Z5.3(E)
TRAY_LOCK_CONTROL_EM_6 [power]: RC17.2 U$8.3 Z6.3(E)
TRAY_LOCK_CONTROL_EM_7 [power]: RC19.2 U$9.3 Z7.3(E)
TRAY_LOCK_CONTROL_EM_8 [power]: RC21.2 U$10.3 Z8.3(E)
TRAY_LOCK_CONTROL_EM_9 [power]: RC23.2 U$11.3 Z9.3(E)
TRAY_LOCK_CONTROL_UC_1: IC12.5((OC3A/AIN1)PE3) OC1.2(A:C)
TRAY_LOCK_CONTROL_UC_2: IC12.15(PH3(OC4A)) OC1.4(B:C)
TRAY_LOCK_CONTROL_UC_3: IC12.16(PH4(OC4B)) OC1.6(C:C)
TRAY_LOCK_CONTROL_UC_4: IC12.17(PH5(OC4C)) OC1.8(D:C)
TRAY_LOCK_CONTROL_UC_5: IC12.18(PH6(OC2B)) OC2.2(A:C)
TRAY_LOCK_CONTROL_UC_6: IC12.23((OC2A/PCINT4)PB4) OC2.4(B:C)
TRAY_LOCK_CONTROL_UC_7: IC12.24((OC1A/PCINT5)PB5) OC2.6(C:C)
TRAY_LOCK_CONTROL_UC_8: IC12.25((OC1B/PCINT6)PB6) OC2.8(D:C)
TRAY_LOCK_CONTROL_UC_9: IC12.26((OC0A/OC1C/PCINT7)PB7) OC4.2(A:C)
TRAY_LOCK_STATUS_1: IC12.78((AD0)PA0) OC6.16(A:COL) RC30.1
TRAY_LOCK_STATUS_1#: OC6.2(A:C) U$13.5
TRAY_LOCK_STATUS_2: IC12.77((AD1)PA1) OC6.14(B:COL) RC31.1
TRAY_LOCK_STATUS_2#: OC6.4(B:C) U$12.5
TRAY_LOCK_STATUS_3: IC12.76((AD2)PA2) OC6.12(C:COL) RC34.1
TRAY_LOCK_STATUS_3#: OC6.6(C:C) U$5.5
TRAY_LOCK_STATUS_4: IC12.75((AD3)PA3) OC6.10(D:COL) RC35.1
TRAY_LOCK_STATUS_4#: OC6.8(D:C) U$6.5
TRAY_LOCK_STATUS_5: IC12.74((AD4)PA4) OC5.16(A:COL) RC36.1
TRAY_LOCK_STATUS_5#: OC5.2(A:C) U$7.5
TRAY_LOCK_STATUS_6: IC12.73((AD5)PA5) OC5.14(B:COL) RC37.1
TRAY_LOCK_STATUS_6#: OC5.4(B:C) U$8.5
TRAY_LOCK_STATUS_7: IC12.72((AD6)PA6) OC5.12(C:COL) RC38.1
TRAY_LOCK_STATUS_7#: OC5.6(C:C) U$9.5
TRAY_LOCK_STATUS_8: IC12.71((AD7)PA7) OC5.10(D:COL) RC39.1
TRAY_LOCK_STATUS_8#: OC5.8(D:C) U$10.5
TRAY_LOCK_STATUS_9 [power]: IC12.60((A15)PC7) OC4.10(D:COL) RC40.1
TRAY_LOCK_STATUS_9#: OC4.8(D:C) U$11.5
TX_0: IC12.2((RXD0/PCIN8)PE0) U$1.TX_0
UVLO: ADJUST_UVLO.1 R32.2 U$37.UVLO
X1 [power]: Q3.2(E) RC3.2
XTAL1: IC12.34(XTAL1) R5.1 Y1.3
XTAL2: IC12.33(XTAL2) R5.2 Y1.1
XX: R35.2 U$37.FLAG U$40.1(A1)
Unconnected: IC12.12(PH0(RXD2)) IC12.13(PH1(TXD2)) IC12.14(PH2(XCK2)) IC12.27(PH7(T4)) IC12.28((TOSC2)PG3) IC12.45((RXD1/INT2)PD2) IC12.46((TXD1/INT3)PD3) IC12.63(PJ0(RXD3/PCINT9)) IC12.64(PJ1(TXD3/PCINT10)) IC12.65(PJ2(XCK3/PCINT11)) IC12.66(PJ3(PCINT12)) IC12.67(PJ4(PCINT13)) IC12.68(PJ5(PCINT14)) IC12.69(PJ6(PCINT15)) IC12.79(PJ7) OC3.1(A:A) OC3.2(A:C) OC3.5(C:A) OC3.6(C:C) OC3.7(D:A) OC3.8(D:C) OC3.9(D:EMIT) OC3.10(D:COL) OC3.11(C:EMIT) OC3.12(C:COL) OC3.15(A:EMIT) OC3.16(A:COL) OC4.3(B:A) OC4.4(B:C) OC4.5(C:A) OC4.6(C:C) OC4.11(C:EMIT) OC4.12(C:COL) OC4.13(B:EMIT) OC4.14(B:COL) U$1.2 U$1.3 U$1.4 U$1.5 U$1.6 U$1.7 U$1.8 U$1.9 U$1.10 U$1.11 U$1.12 U$1.13 U$1.A0 U$1.A1 U$1.A2 U$1.A3 U$1.A4 U$1.A5 U$5.6 U$6.6 U$7.6 U$8.6 U$9.6 U$10.6 U$11.6 U$12.6 U$13.6 Z1.2@1(C/) Z2.2@1(C/) Z3.2@1(C/) Z4.2@1(C/) Z5.2@1(C/) Z6.2@1(C/) Z7.2@1(C/) Z8.2@1(C/) Z9.2@1(C/)

### Notes on the sheet
- Protection circuit
- OVER AND UNDER VOLTAGE
- SET CURRENT
- Dragino Yun Shield
- D29
- D28
- D27 | Buzzer Circuit
- D26
- D25
- D24
- D23
- D22
- pwm/D13
- pwm/D12
- BUZZER(+VE)
- pwm/D11
- pwm/D10
- D50 | (MISO)
- D51 | (MOSI)
- D52
- (SCK)
- D53
- D30
- D31
- D32
- D33
- D34
- D35
- D36
- D42 | D37
- D43
- pwm | D44 | D38
- pwm | D45
- pwm | D46
- D47
- D48 | D18 | TX1
- D49 | D19 | RX1
- D20/SDA
- A15 | D21/SCL
- A14
- A13
- A12
- A11 | pwm/D3
- 12V POWER INPUT | POWER DISTRIBUTION
- A10 | pwm/D2
- A9 | pwm/D5
- A8
- D1 | (TX0)
- D0 | (RX0)
- A7
- A6
- A5
- A4
- TX3/D14 | A3
- RX3/D15 | A2
- A1
- A0
- pwm | D9
- pwm/D4
- pwm | D8
- pwm/D7
- pwm/D6
- D39
- TX2/D16 | D40
- RX2/D17 | D41
- SPI | I2C
- RGB CHANNEL 
  & RESET
- RFID

## Sheet 2 of 5

## Sheet 3 of 5

## Sheet 4 of 5

## Sheet 5 of 5

## Library data of the parts
12V_POWER_JACK = con-jack:DCJ0202: DC POWER JACK Source: DCJ0202.pdf; OC_FARNELL: unknown; OC_NEWARK: unknown
+5V_SUPPLY RESET = con-phoenix-254:MPT2: PHOENIX CONNECTOR; OC_FARNELL: unknown; OC_NEWARK: unknown
ADJUST_OVLO ADJUST_UVLO R5 R6 R15 R15_BYPASS8 R17-R19 R31-R33 R35 = SmartPrj:R-EU_: RESISTOR, European symbol
C1 C3 C4 C6 C11-C13 C15 C19 = SmartPrj:C-EU: CAPACITOR, European symbol
C2 = rcl:C-US: CAPACITOR, American symbol
D1 = diode:DIODE-: DIODE
D2 = 1sma59xx_10:1SMA59*BT3G: 1SMA59xxBT3G Series 1.5 Watt Plastic Surface Mount Zener Voltage Regulators Source: http://www.onsemi.com/pub_link/Collateral/1SMA5913BT3-D.PDF; MF: ON Semiconductor; MPN: 1SMA5925BT3G; OC_FARNELL: 1431147; OC_NEWARK: 71J9198
D3 = Discrete:D*
I2C-1 I2C-2 SPI = con-molex:22-23-2041: .100" (2.54mm) Center Header - 4 Pin; MF: MOLEX; MPN: 22-23-2041; OC_FARNELL: 1462920; OC_NEWARK: 38C0355
IC1 = SteelCaveRobotics-Power:TSR1-2450: Traco Power TSR 1-2450 5.0v switching regulator
IC12 = SmartPrj:ATMEGA2560: MICROCONTROLLER 64/128/256 Kbytes FLASH 4 Kbytes EEPROM 8 Kbytes SRAM 86 General Purpose I/O pins 12-channels16-bit PWM 4 x Serial USARTs 16-channels 10-bit A/D
OC1-OC6 = avago:ACPL-247
PC4 = rcl:CPOL-EU: POLARIZED CAPACITOR, European symbol
PFET-1 = FQP47P06:FQP47P06
POWER = con-wago-500:W237-102: WAGO SCREW CLAMP; MPN: 237-102; OC_FARNELL: unknown; OC_NEWARK: 70K9898
PWR-LED PWR-LED1 = SparkFun:LED: LEDs Standard schematic elements and footprints for 5mm, 3mm, 1206, and 0603 sized LEDs. 5mm - Spark Fun Electronics SKU : COM-00529 (and others)
Q3 = Discrete:TRANSISTOR-NPN*: NPN audion
R1 R2 RPL = SparkFun:RESISTOR: Resistor Basic schematic elements and footprints for 0603, 1206, and PTH resistors.
R3 R4 R8-R14 R16 R20-R30 R34 R36 R69 R83-R122 RC2 RC3 RC5-RC7 RC9-RC23 RC30 RC31 RC34-RC49 RRST = resistor:R-US_: RESISTOR, American symbol
R7 = resistor:R-EU_: RESISTOR, European symbol
RFID-1-RFID-8 U$53 = Molex-105309-1104:MOLEX-105309-1104
RGB = con-molex:22-23-2031: .100" (2.54mm) Center Header - 3 Pin; MF: MOLEX; MPN: 22-23-2031; OC_FARNELL: 1462950; OC_NEWARK: 30C0862
SPI-1 SPI-2 = con-molex:22-23-2051: .100" (2.54mm) Center Header - 5 Pin; MF: MOLEX; MPN: 22-23-2051; OC_FARNELL: 1462952; OC_NEWARK: 38C9178
U2 = SN65HVD09DGGR11:SN65HVD09DGGR: 9-CHANNEL RS-422 / RS-485 TRANSCEIVER; DESCRIPTION: Nine Transmitter/Receiver RS-422/RS-485 56-Pin TSSOP T/R; DIGI-KEY_PART_NUMBER: 296-24051-1-ND; DIGI-KEY_PURCHASE_URL: https://www.digikey.in/product-detail/en/texas-instruments/SN65HVD09DGGR/296-24051-1-ND/1990144?utm_source=snapeda&utm_medium=aggregator&utm_campaign=symbol; MF: Texas Instruments; MP: SN65HVD09DGGR; PACKAGE: TSSOP-56 Texas Instruments
U$1 = Dragino_shield:DRAGINO_SHIELD
U$2 U$3 = Buzzer:BUZZER
U$4 U$14-U$30 = GG0402050R3C2P:GG0402050R3C2P
U$5-U$13 = 43045-0624_connector_2X3:43045-0624-0624_CONNECTOR_2X3
U$31-U$36 = SOT:NUP1301
U$37 = MAX14571:MAX14571
U$38 = STPS5L60S:STPS5L60S
U$39 = ref-packages:SM6T36CA
U$40 = ref-packages:NC7WZ07P6X
U$41-U$44 = EEVFK1H331Q:EEV-FK1H331Q
Y1 = SmartPrj:RESONATOR
Z1-Z9 = semicon-smd-ipc:NPN-TRANSISTIOR-2COL: NPN TRANSISTOR 2 colletor pins

## Net classes
0 default: width 0.254 mm, drill 0.254 mm, clearance 0.152 mm
1 power: width 0.508 mm, drill 0.406 mm, clearance 0.305 mm
3 GND: width 0.508 mm, drill 0.406 mm, clearance 0.305 mm
5 PWR: width 1.016 mm, drill 1.016 mm, clearance 0.254 mm